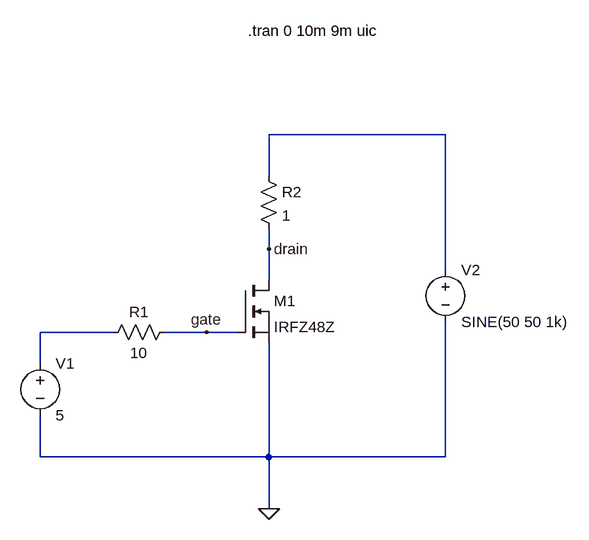
[diagram p0: schematic Mosfet_characteristics.asc]
Mosfet_characteristics.asc, the LTspice schematic file:
Version 4
SHEET 1 880 680
WIRE 496 -112 224 -112
WIRE 224 -48 224 -112
WIRE 224 64 224 32
WIRE 496 96 496 -112
WIRE 224 112 224 64
WIRE -16 192 -128 192
WIRE 128 192 64 192
WIRE 176 192 128 192
WIRE -128 240 -128 192
WIRE -128 384 -128 320
WIRE 224 384 224 208
WIRE 224 384 -128 384
WIRE 496 384 496 176
WIRE 496 384 224 384
WIRE 224 464 224 384
FLAG 224 464 0
FLAG 224 64 drain
FLAG 128 192 gate
SYMBOL nmos 176 112 R0
SYMATTR InstName M1
SYMATTR Value IRFZ48Z
SYMBOL res 80 176 R90
WINDOW 0 0 56 VBottom 2
WINDOW 3 32 56 VTop 2
SYMATTR InstName R1
SYMATTR Value 10
SYMBOL voltage -128 224 R0
WINDOW 123 0 0 Left 0
WINDOW 39 0 0 Left 0
SYMATTR InstName V1
SYMATTR Value 5
SYMBOL res 208 -64 R0
SYMATTR InstName R2
SYMATTR Value 1
SYMBOL voltage 496 80 R0
WINDOW 123 0 0 Left 0
WINDOW 39 0 0 Left 0
SYMATTR InstName V2
SYMATTR Value SINE(50 50 1k)
TEXT 192 -272 Left 2 !.tran 0 10m 9m uic

The netlist it stands for:
* Mosfet_characteristics.asc
M1 drain gate 0 0 IRFZ48Z
R1 gate N002 10
V1 N002 0 5
R2 N001 drain 1
V2 N001 0 SINE(50 50 1k)
.model NMOS NMOS
.model PMOS PMOS
.lib standard.mos
.tran 0 10m 9m uic
.backanno
.end